# EasyEDA schematic SCH_UART-HMI-OLED_2026-03-10.json
TITLE: UART HMI OLED; REV: 1.0; Date: 2026-03-09; Sheet: 1/1; Drawn By: tobychui; Company: imuslab
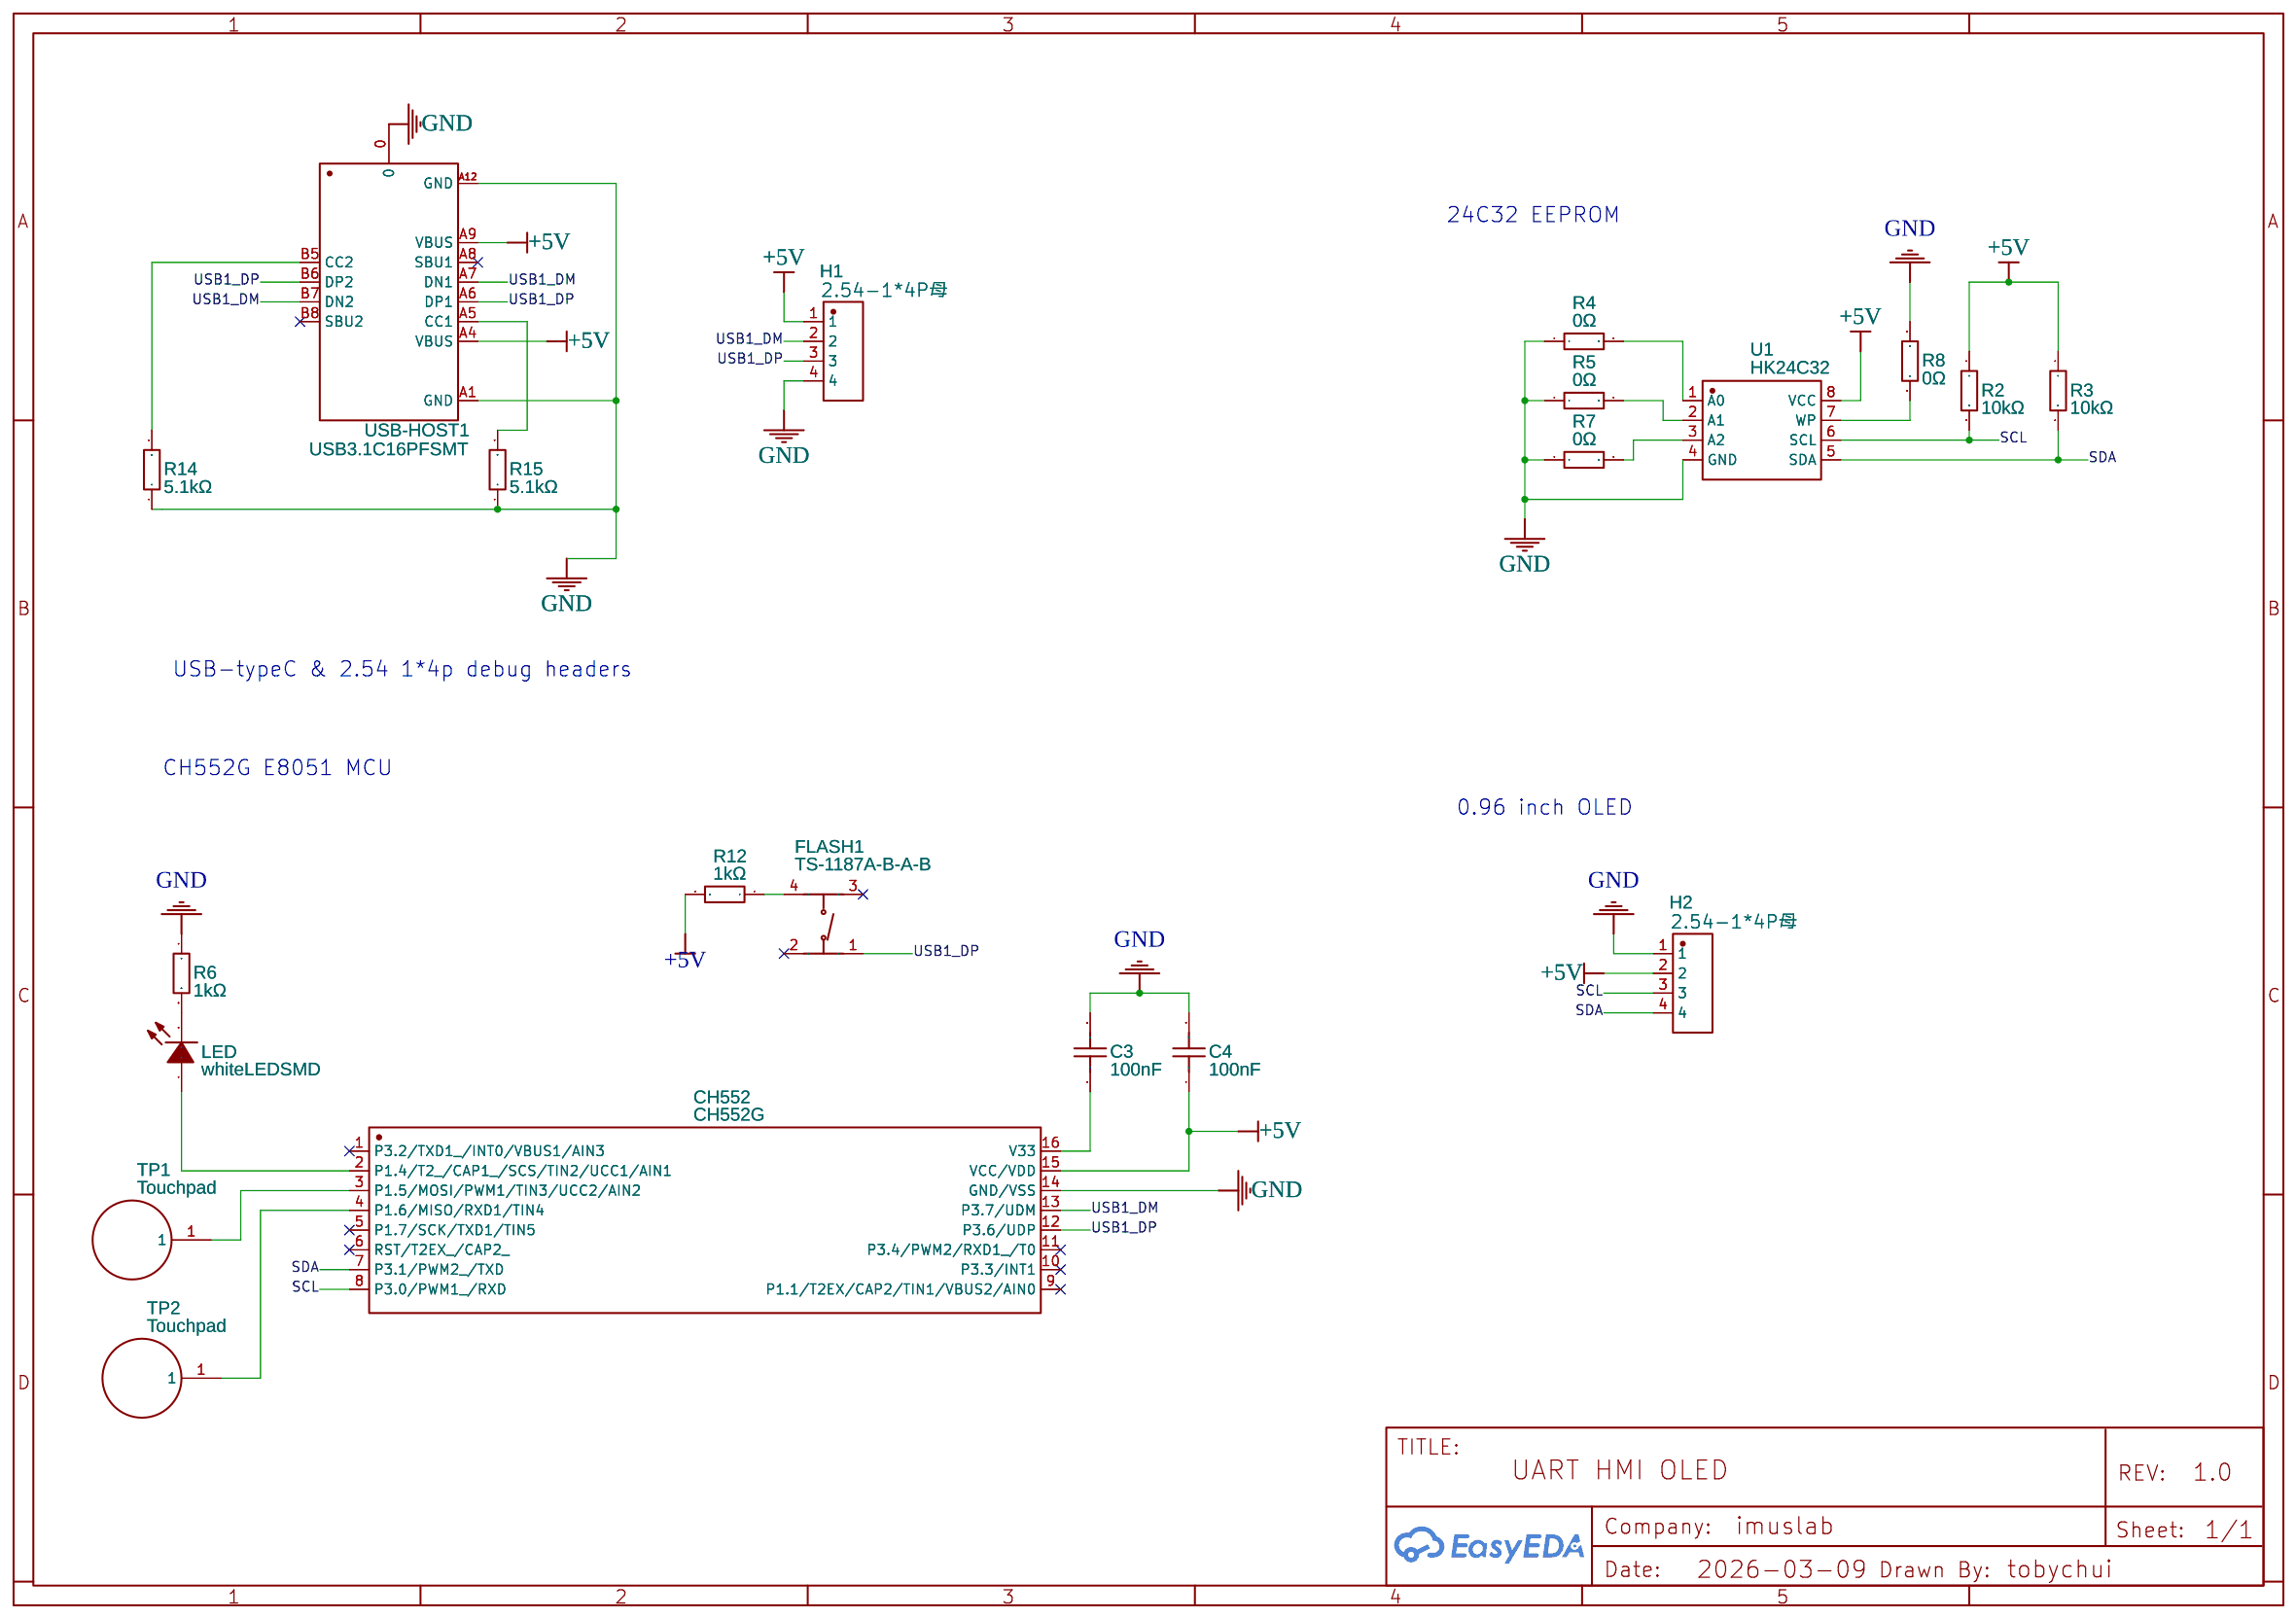
[diagram p0: schematic sheet]

## Parts
C3  100nF  [C0805]
C4  100nF  [C0805]
CH552  CH552G  [SOP-16_L10.0-W3.9-P1.27-LS6.0-BL]
FLASH1  TS-1187A-B-A-B  [SW-SMD_4P-L5.1-W5.1-P3.70-LS6.5-TL_H1.5]
H1  2.54-1*4P母  [HDR-TH_4P-P2.54-V-F]
H2  2.54-1*4P母  [HDR-TH_4P-P2.54-V-F]
LED  whiteLEDSMD  [LED0805-R-RD]
R2  10kΩ  [R0805]
R3  10kΩ  [R0805]
R4  0Ω  [R0805]
R5  0Ω  [R0805]
R6  1kΩ  [R0805]
R7  0Ω  [R0805]
R8  0Ω  [R0805]
R12  1kΩ  [R0805]
R14  5.1kΩ  [R0805]
R15  5.1kΩ  [R0805]
TP1  Touchpad  [TOUCHPAD]
TP2  Touchpad  [TOUCHPAD]
U1  HK24C32  [SOP-8_L4.9-W3.9-P1.27-LS6.0-BL]
USB-HOST1  USB3.1C16PFSMT  [USB-C-SMD_TYPE-C-USB-17]

## Library data of the parts
C3 C4 = CC0805KRX7R9BB104: Supplier: LCSC; Manufacturer: YAGEO(国巨); Supplier Part: C49678; JLCPCB Part Class: Basic Part
CH552 = CH552G: Supplier: LCSC; Manufacturer: WCH(南京沁恒); Supplier Part: C111292; JLCPCB Part Class: Extended Part
FLASH1 = TS-1187A-B-A-B: Contributor: LCSC; Supplier: LCSC; Supplier Part: C318884; Manufacturer: XKB Connectivity(中国星坤); JLCPCB Part Class: Basic Part
H1 H2 = 2.54-1*4P母: Contributor: LCSC; Supplier: LCSC; Supplier Part: C2718488; Manufacturer: BOOMELE(博穆精密); JLCPCB Part Class: Extended Part
LED = whiteLEDSMD: Supplier: LCSC; Manufacturer: KENTO; Manufacturer Part: KT-0805W; Supplier Part: C34499; JLCPCB Part Class: Basic Part
R2 R3 = 0805W8F1002T5E: Supplier: LCSC; Manufacturer: UNI-ROYAL(厚声); Supplier Part: C17414; JLCPCB Part Class: Basic Part
R4 R5 R7 R8 = 0805W8F0000T5E: Supplier: LCSC; Manufacturer: UNI-ROYAL(厚声); Supplier Part: C17477; JLCPCB Part Class: Basic Part
R6 R12 = 0805W8F1001T5E: Supplier: LCSC; Manufacturer: UNI-ROYAL(厚声); Supplier Part: C17513; JLCPCB Part Class: Basic Part
R14 R15 = 0805W8F5101T5E: Supplier: LCSC; Manufacturer: UNI-ROYAL(厚声); Supplier Part: C27834; JLCPCB Part Class: Basic Part
TP1 TP2 = Touchpad: Contributor: Stefan Wagner
U1 = HK24C32: Contributor: LCSC; Supplier: LCSC; Supplier Part: C495288; Manufacturer: HK(航顺); JLCPCB Part Class: Extended Part
USB-HOST1 = USB3.1C16PFSMT: Contributor: LCSC; Supplier: LCSC; Supplier Part: C167321; Manufacturer: 精拓金; Manufacturer Part: 918-418K2023S40001; JLCPCB Part Class: Extended Part

## Nets
+5V: C4.1 CH552.15(VCC/VDD) H1.1 H2.2 R2.1 R3.1 R12.2 U1.8(VCC) USB-HOST1.A4(VBUS) USB-HOST1.A9(VBUS)
GND: C3.2 C4.2 CH552.14(GND/VSS) H1.4 H2.1 R4.1 R5.1 R6.1 R7.1 R8.2 R14.1 R15.1 U1.4(GND) USB-HOST1.0 USB-HOST1.A1(GND) USB-HOST1.A12(GND)
SCL: CH552.8(P3.0/PWM1_/RXD) H2.3 R2.2 U1.6(SCL)
SDA: CH552.7(P3.1/PWM2_/TXD) H2.4 R3.2 U1.5(SDA)
USB1_DM: CH552.13(P3.7/UDM) H1.2 USB-HOST1.A7(DN1) USB-HOST1.B7(DN2)
USB1_DP: CH552.12(P3.6/UDP) FLASH1.1(A) H1.3 USB-HOST1.A6(DP1) USB-HOST1.B6(DP2)
Net-(C3-1): C3.1 CH552.16(V33)
Net-(CH552-2): CH552.2(P1.4/T2_/CAP1_/SCS/TIN2/UCC1/AIN1) LED.1(A)
Net-(CH552-3): CH552.3(P1.5/MOSI/PWM1/TIN3/UCC2/AIN2) TP1.1
Net-(CH552-4): CH552.4(P1.6/MISO/RXD1/TIN4) TP2.1
Net-(FLASH1-4): FLASH1.4(D) R12.1
Net-(LED-2): LED.2(K) R6.2
Net-(R4-2): R4.2 U1.1(A0)
Net-(R5-2): R5.2 U1.2(A1)
Net-(R7-2): R7.2 U1.3(A2)
Net-(R8-1): R8.1 U1.7(WP)
Net-(R14-2): R14.2 USB-HOST1.B5(CC2)
Net-(R15-2): R15.2 USB-HOST1.A5(CC1)

Not connected (* = marked no-connect by the designer): CH552 1(P3.2/TXD1_/INT0/VBUS1/AIN3)* 5(P1.7/SCK/TXD1/TIN5)* 6(RST/T2EX_/CAP2_)* 9(P1.1/T2EX/CAP2/TIN1/VBUS2/AIN0)* 10(P3.3/INT1)* 11(P3.4/PWM2/RXD1_/T0)*; FLASH1 2(B)* 3(C)*; USB-HOST1 A8(SBU1)* B8(SBU2)*

## Notes on the sheet
- 24C32 EEPROM
- USB-typeC & 2.54 1*4p debug headers
- CH552G E8051 MCU
- 0.96 inch OLED
